# Altium schematic sheet module 4_TEMP_HUMIDITY.SchDoc
size 228 x 148 mm
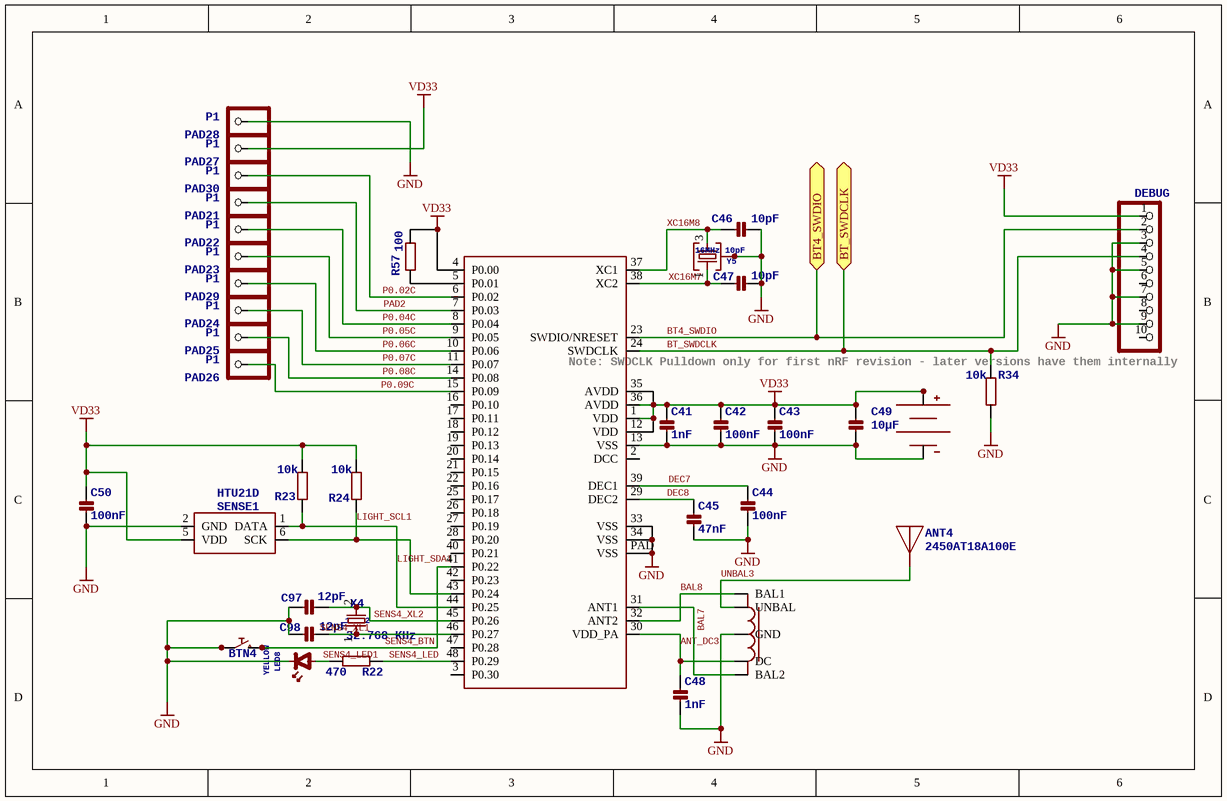
[diagram p0: module 4_TEMP_HUMIDITY.SchDoc]

## Parts
ANT4  2450AT18A100E  [1206_MINIMELF_COMBO]
BALUN4  2450BM14A0002T  [6-PIN-0603]  (value not drawn)
BAT4  BATTERYBK-912  [BK-912]  (value not drawn)
BT4  NRF51822QFN48  [QFN48_EP]  (value not drawn)
BTN4  Tact Sw 4.6x2.8  [CK-KMR2]  (value not drawn)
C41  1nF  [0402]
C42  100nF  [0402]
C43  100nF  [0402]
C44  100nF  [0402]
C45  47nF  [0402]
C46  10pF  [0402]
C47  10pF  [0402]
C48  1nF  [0402]
C49  10µF  [0603]
C50  100nF  [0402]
C97  12pF  [0402]
C98  12pF  [0402]
DEBUG4  DEBUG  [2X05_SMT]  (no BOM)
LED8  YELLOW  [0402_POLAR]
PAD21  P1  [PCB_MEDIUM_RECT_PAD]  (no BOM)
PAD22  P1  [PCB_MEDIUM_RECT_PAD]  (no BOM)
PAD23  P1  [PCB_MEDIUM_RECT_PAD]  (no BOM)
PAD24  P1  [PCB_MEDIUM_RECT_PAD]  (no BOM)
PAD25  P1  [PCB_MEDIUM_RECT_PAD]  (no BOM)
PAD26  P1  [PCB_MEDIUM_RECT_PAD]  (no BOM)
PAD27  P1  [PCB_MEDIUM_RECT_PAD]  (no BOM)
PAD28  P1  [PCB_MEDIUM_RECT_PAD]  (no BOM)
PAD29  P1  [PCB_MEDIUM_RECT_PAD]  (no BOM)
PAD30  P1  [PCB_MEDIUM_RECT_PAD]  (no BOM)
R22  470  [0402]
R23  10k  [0402]
R24  10k  [0402]
R34  10k  [0402]
R57  100  [0402]
SENSE1  HTU21D  [HTU21D]
X4  32.768 KHz  [1206_MINIMELF_COMBO]
Y5  16MHz 10pF  [CRYSTAL25X20]

## Ports
BT4_SWDIO, BT_SWDCLK

## Nets
GND: BALUN4.2(GND) BAT4.- BT4.13(VSS) BT4.33(VSS) BT4.34(VSS) BT4.PAD(VSS) BTN4.P1 BTN4.P2 C41.2 C42.2 C43.2 C44.2 C45.2 C46.2 C47.2 C48.2 C49.2(P2) C50.2 C97.1 C98.1 DEBUG4.3 DEBUG4.5 DEBUG4.7 DEBUG4.9 LED8.K(CATHODE) PAD28.1 R34.1 SENSE1.2(GND) Y5.2 Y5.4
VD33: BAT4.+1(+) BAT4.+2(+) BT4.1(VDD) BT4.4(P0.00) BT4.12(VDD) BT4.35(AVDD) BT4.36(AVDD) C41.1 C42.1 C43.1 C49.1(P1) C50.1 DEBUG4.1 PAD27.1 R23.2 R24.2 R57.1 SENSE1.5(VDD)
ANT_DC3: BALUN4.5(DC) BT4.30(VDD_PA) C48.1
BAL7: BALUN4.4(BAL2) BT4.31(ANT1)
BAL8: BALUN4.3(BAL1) BT4.32(ANT2)
BT4_SWDIO: BT4.23(SWDIO/NRESET) DEBUG4.2 ; port BT4_SWDIO
BT_SWDCLK: BT4.24(SWDCLK) DEBUG4.4 R34.2 ; port BT_SWDCLK
DEC7: BT4.39(DEC1) C44.1
DEC8: BT4.29(DEC2) C45.1
LIGHT_SCL1: BT4.43(P0.24) R24.1 SENSE1.6(SCK)
LIGHT_SDA1: BT4.44(P0.25) R23.1 SENSE1.1(DATA)
P0.02C: BT4.6(P0.02) PAD30.1
P0.04C: BT4.8(P0.04) PAD22.1
P0.05C: BT4.9(P0.05) PAD23.1
P0.06C: BT4.10(P0.06) PAD29.1
P0.07C: BT4.11(P0.07) PAD24.1
P0.08C: BT4.14(P0.08) PAD25.1
P0.09C: BT4.15(P0.09) PAD26.1
PAD2: BT4.7(P0.03) PAD21.1
SENS4_BTN: BT4.41(P0.22) BTN4.P3 BTN4.P4
SENS4_LED: BT4.48(P0.29) R22.1
SENS4_LED1: LED8.A(ANODE) R22.2
SENS4_XL2: BT4.45(P0.26) C97.2 X4.2
UNBAL3: ANT4.1(ANT) BALUN4.1(UNBAL)
XC16M7: BT4.38(XC2) C47.1 Y5.1
XC16M8: BT4.37(XC1) C46.1 Y5.3
NetBT4_5: BT4.5(P0.01) R57.2
NetBT4_46: BT4.46(P0.27) C98.2 X4.1

Not connected (* = marked no-connect by the designer): BT4 2(DCC) 3(P0.30) 16(P0.10) 17(P0.11) 18(P0.12) 19(P0.13) 20(P0.14) 21(P0.15) 22(P0.16) 25(P0.17) 26(P0.18) 27(P0.19) 28(P0.20) 40(P0.21) 42(P0.23) 47(P0.28); DEBUG4 6 8 10

## Notes on the sheet
- (near BT4) Note: SWDCLK Pulldown only for first nRF revision - later versions have them internally
- Labels drawn without touching a wire or pin: SENS4_XL1

## Library data of the parts
ANT4 = ANTENNA_MONOPOLE1206: 2.45 GHz Antenna; SMD: Yes
BALUN4 = BALUN: 2.45 GHz Impedance Matched Balun-Filter; SMD: Yes
BAT4 = BATTERYBK-912: Coin battery holder; SMD: Yes
BT4 = NRF51822QFN48: Nordic Bluetooth 4.0 low energy modul; SMD: Yes
BTN4 = PUSHBUTTONKMR2XX: Push button; SMD: Yes
C41-C48 C50 C97 C98 = CAP_CERAMIC0402: Ceramic Capacitor; SMD: Yes
C49 = CAP_CERAMIC0603: Ceramic Capacitor; SMD: Yes
DEBUG4 = HEADER-2X5SMD-1.27MM: cortex DEBUG connector
LED8 = LED0402: LED common; SMD: Yes
PAD21-PAD30 = HEADER-1X1SMD_MEDIUM: <b>PIN HEADER</b>
R22-R24 R34 R57 = R-EU_0402: RESISTOR; SMD: Yes
SENSE1 = HTU21D: Humidity and temperature sensor; SMD: Yes
X4 = CRYSTAL1206: CL05C120JB5; 1: 1; 2: 2; SMD: Yes
Y5 = CRYSTAL_WITH_GROUND25X20: 16MHz crystal 2.5x2mm; SMD: Yes